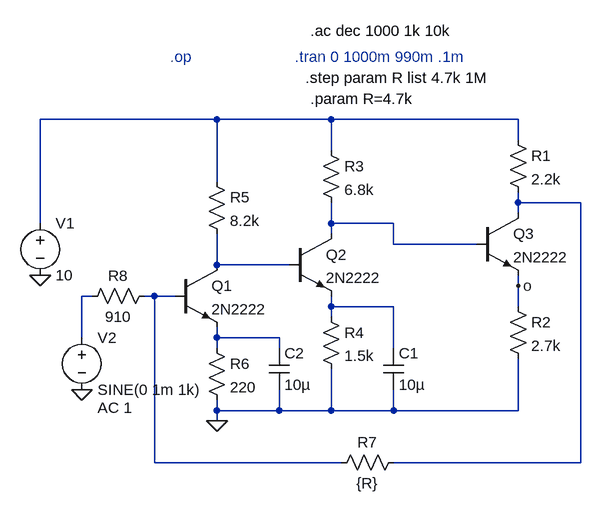
[diagram p0: schematic parcial 1 2024.asc]
parcial 1 2024.asc, the LTspice schematic file:
Version 4.1
SHEET 1 880 680
WIRE 224 -96 -48 -96
WIRE 400 -96 224 -96
WIRE 688 -96 400 -96
WIRE 688 -64 688 -96
WIRE 400 -48 400 -96
WIRE 224 0 224 -96
WIRE 688 32 688 16
WIRE 784 32 688 32
WIRE 688 48 688 32
WIRE -48 64 -48 -96
WIRE 400 64 400 32
WIRE 496 64 400 64
WIRE 400 80 400 64
WIRE 496 96 496 64
WIRE 624 96 496 96
WIRE 224 128 224 80
WIRE 336 128 224 128
WIRE 688 160 688 144
WIRE 32 176 16 176
WIRE 128 176 112 176
WIRE 160 176 128 176
WIRE 400 192 400 176
WIRE 496 192 400 192
WIRE 688 192 688 160
WIRE 400 208 400 192
WIRE 16 240 16 176
WIRE 224 240 224 224
WIRE 320 240 224 240
WIRE 224 256 224 240
WIRE 320 256 320 240
WIRE 496 256 496 192
WIRE 224 352 224 336
WIRE 320 352 320 320
WIRE 320 352 224 352
WIRE 400 352 400 288
WIRE 400 352 320 352
WIRE 496 352 496 320
WIRE 496 352 400 352
WIRE 688 352 688 272
WIRE 688 352 496 352
WIRE 224 368 224 352
WIRE 128 432 128 176
WIRE 416 432 128 432
WIRE 784 432 784 32
WIRE 784 432 496 432
FLAG -48 144 0
FLAG 224 368 0
FLAG 688 160 o
FLAG 16 320 0
DATAFLAG 688 176 ""
SYMBOL npn 160 128 R0
SYMATTR InstName Q1
SYMATTR Value 2N2222
SYMBOL npn 336 80 R0
SYMATTR InstName Q2
SYMATTR Value 2N2222
SYMBOL npn 624 48 R0
SYMATTR InstName Q3
SYMATTR Value 2N2222
SYMBOL res 672 -80 R0
SYMATTR InstName R1
SYMATTR Value 2.2k
SYMBOL res 672 176 R0
SYMATTR InstName R2
SYMATTR Value 2.7k
SYMBOL res 384 -64 R0
SYMATTR InstName R3
SYMATTR Value 6.8k
SYMBOL res 384 192 R0
SYMATTR InstName R4
SYMATTR Value 1.5k
SYMBOL res 208 -16 R0
SYMATTR InstName R5
SYMATTR Value 8.2k
SYMBOL res 208 240 R0
SYMATTR InstName R6
SYMATTR Value 220
SYMBOL voltage -48 48 R0
WINDOW 123 0 0 Left 0
WINDOW 39 0 0 Left 0
SYMATTR InstName V1
SYMATTR Value 10
SYMBOL res 512 416 R90
WINDOW 0 0 56 VBottom 2
WINDOW 3 32 56 VTop 2
SYMATTR InstName R7
SYMATTR Value {R}
SYMBOL res 128 160 R90
WINDOW 0 0 56 VBottom 2
WINDOW 3 32 56 VTop 2
SYMATTR InstName R8
SYMATTR Value 910
SYMBOL cap 480 256 R0
SYMATTR InstName C1
SYMATTR Value 10µ
SYMBOL cap 304 256 R0
SYMATTR InstName C2
SYMATTR Value 10µ
SYMBOL voltage 16 224 R0
WINDOW 123 24 124 Left 2
WINDOW 39 0 0 Left 0
SYMATTR Value2 AC 1
SYMATTR InstName V2
SYMATTR Value SINE(0 1m 1k)
TEXT 152 -192 Left 2 ;.op
TEXT 368 -232 Left 2 !.ac dec 1000 1k 10k
TEXT 344 -192 Left 2 ;.tran 0 1000m 990m .1m
TEXT 360 -160 Left 2 !.step param R list 4.7k 1M
TEXT 368 -128 Left 2 !.param R=4.7k

The netlist it stands for:
* parcial 1 2024.asc
Q1 N004 N006 N008 0 2N2222
Q2 N003 N004 N007 0 2N2222
Q3 N002 N003 o 0 2N2222
R1 N001 N002 2.2k
R2 o 0 2.7k
R3 N001 N003 6.8k
R4 N007 0 1.5k
R5 N001 N004 8.2k
R6 N008 0 220
V1 N001 0 10
R7 N002 N006 {R}
R8 N006 N005 910
C1 N007 0 10µ
C2 N008 0 10µ
V2 N005 0 SINE(0 1m 1k) AC 1
.model NPN NPN
.model PNP PNP
.lib standard.bjt
* .op
.ac dec 1000 1k 10k
* .tran 0 1000m 990m .1m
.step param R list 4.7k 1M
.param R=4.7k
.backanno
.end